# EasyEDA Pro project ProPrj_Pi Essential HAT.epro, schematic Schematic1
Board Name: Board1; Create Date: 2026-06-19; Page Name: P1; Project Name: Pi Essential HAT; Schematic Name: Schematic1; Update Date: 2026-06-19; Company: EasyEDA.com; Page Size: A4; Version: V1.0
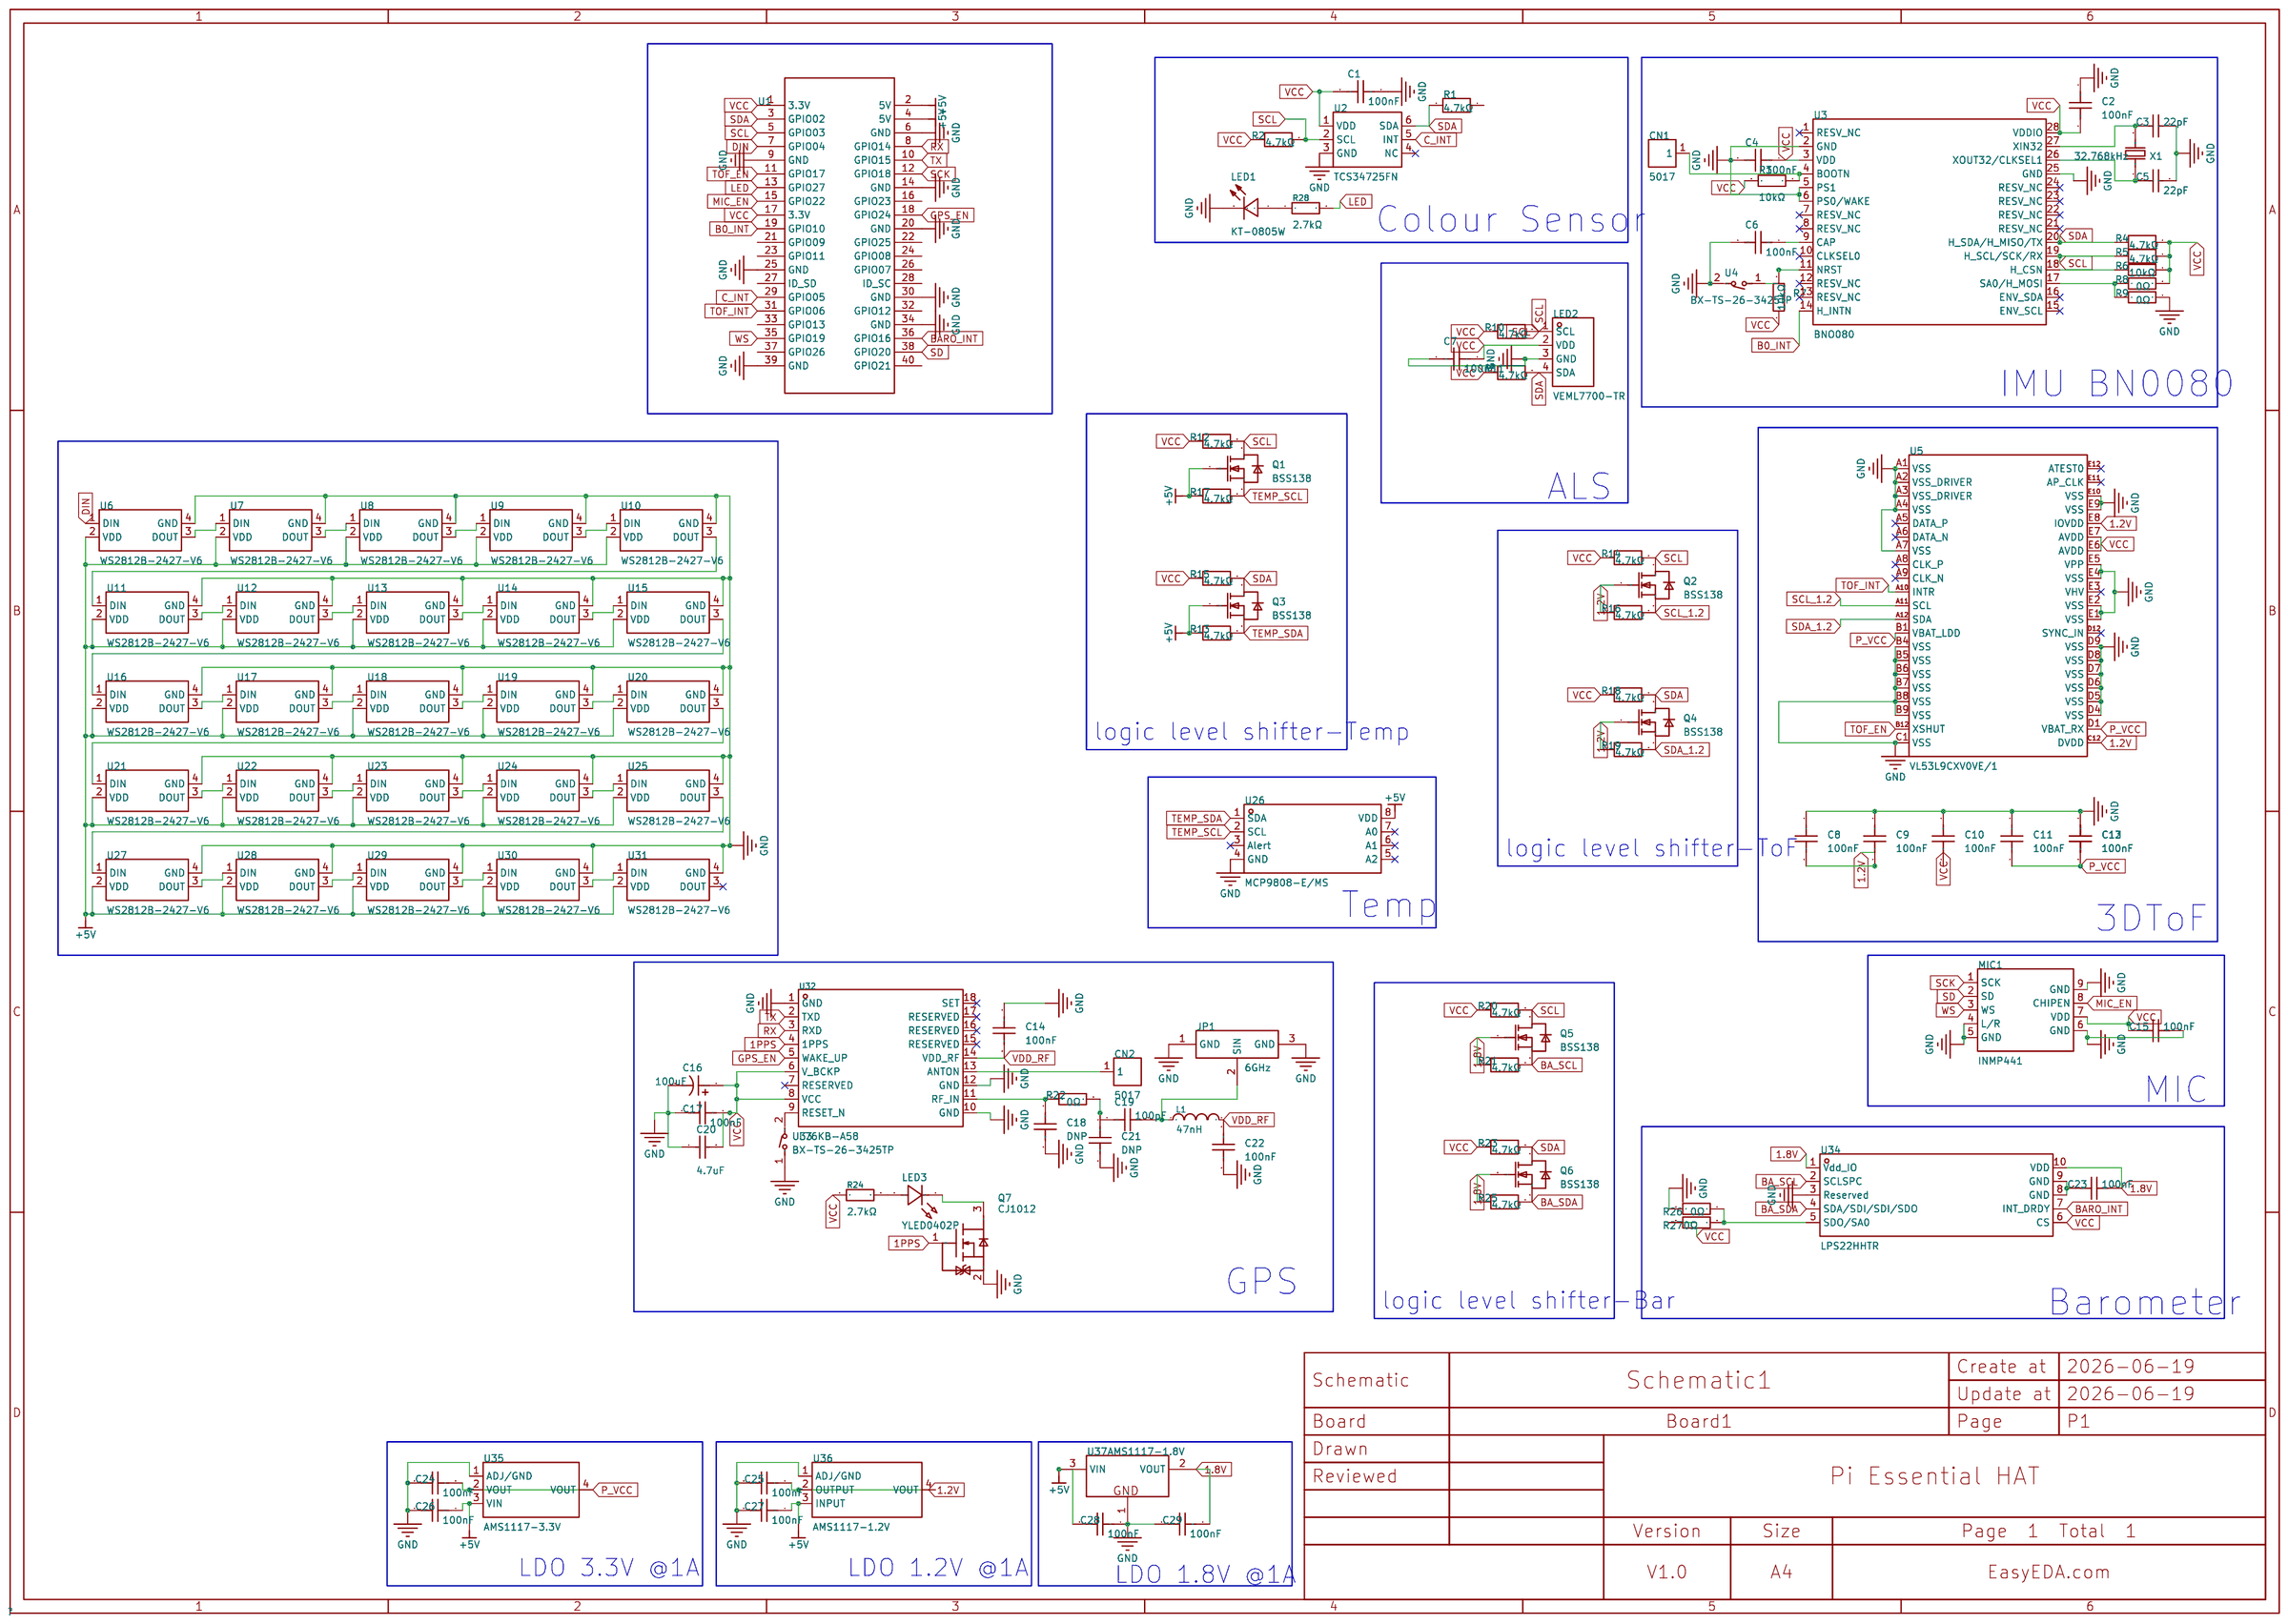
[diagram p0: schematic sheet]

## Parts
C1  100nF  [C0201]
C2  100nF  [C0201]
C3  22pF  [C0402]
C4  100nF  [C0201]
C5  22pF  [C0402]
C6  100nF  [C0201]
C7  100nF  [C0201]
C8  100nF  [C0201]
C9  100nF  [C0201]
C10  100nF  [C0201]
C11  100nF  [C0201]
C12  100nF  [C0201]
C13  100nF  [C0201]
C14  100nF  [C0201]
C15  100nF  [C0201]
C16  100uF  [CAP-SMD_BD5.0-L5.3-W5.3-RD]
C17  100nF  [C0201]
C18  DNP  [C0603]
C19  100pF  [C0201]
C20  4.7uF  [C0201]
C21  DNP  [C0603]
C22  100nF  [C0201]
C23  100nF  [C0201]
C24  100nF  [C0201]
C25  100nF  [C0201]
C26  100nF  [C0201]
C27  100nF  [C0201]
C28  100nF  [C0201]
C29  100nF  [C0201]
CN1  5017  [CONN-SMD_5017]
CN2  5017  [CONN-SMD_5017]
JP1  6GHz  [ANT-SMD_UFL-R-SMT-1-10]
L1  47nH  [L0201-RD]
LED1  KT-0805W  [LED0805-R-RD]
LED2  VEML7700-TR  [LED-SMD_4P-L6.8-W2.4_VEML7700-TR]
LED3  YLED0402P  [LED0402-RD]
MIC1  INMP441  [MIC-SMD_INMP441]
Q1  BSS138  [SOT-23-3_L2.9-W1.3-P1.90-LS2.4-BR-1]
Q2  BSS138  [SOT-23-3_L2.9-W1.3-P1.90-LS2.4-BR-1]
Q3  BSS138  [SOT-23-3_L2.9-W1.3-P1.90-LS2.4-BR-1]
Q4  BSS138  [SOT-23-3_L2.9-W1.3-P1.90-LS2.4-BR-1]
Q5  BSS138  [SOT-23-3_L2.9-W1.3-P1.90-LS2.4-BR-1]
Q6  BSS138  [SOT-23-3_L2.9-W1.3-P1.90-LS2.4-BR-1]
Q7  CJ1012  [SOT-523_L1.6-W0.8-P1.00-LS1.6-BR]
R1  4.7kΩ  [R0201]
R2  4.7kΩ  [R0201]
R3  10kΩ  [R0201]
R4  4.7kΩ  [R0201]
R5  4.7kΩ  [R0201]
R6  10kΩ  [R0201]
R7  10kΩ  [R0201]
R8  0Ω  [R0402]
R9  0Ω  [R0402]
R10  4.7kΩ  [R0201]
R11  4.7kΩ  [R0201]
R12  4.7kΩ  [R0201]
R13  4.7kΩ  [R0201]
R14  4.7kΩ  [R0201]
R15  4.7kΩ  [R0201]
R16  4.7kΩ  [R0201]
R17  4.7kΩ  [R0201]
R18  4.7kΩ  [R0201]
R19  4.7kΩ  [R0201]
R20  4.7kΩ  [R0201]
R21  4.7kΩ  [R0201]
R22  0Ω  [R0402]
R23  4.7kΩ  [R0201]
R24  2.7kΩ  [R0402]
R25  4.7kΩ  [R0201]
R26  0Ω  [R0402]
R27  0Ω  [R0402]
R28  2.7kΩ  [R0402]
U1  -  [RASPI_GPIO_B+_PIN]
U2  TCS34725FN  [SENSOR-SMD_TCS34725FN]
U3  BNO080  [LGA-28_L5.2-W3.8-P0.50-BL-1]
U4  BX-TS-26-3425TP  [KEY-SMD_L3.9-W3.0-LS5.0-EH]
U5  VL53L9CXV0VE/1  [COMM-SMD_42P-L12.8-W6.1_VL53L9CXV0VE-1]
U6  WS2812B-2427-V6  [LED-SMD_4P-L2.7-W2.4-P1.30_WS2812B-2427-V6]
U7  WS2812B-2427-V6  [LED-SMD_4P-L2.7-W2.4-P1.30_WS2812B-2427-V6]
U8  WS2812B-2427-V6  [LED-SMD_4P-L2.7-W2.4-P1.30_WS2812B-2427-V6]
U9  WS2812B-2427-V6  [LED-SMD_4P-L2.7-W2.4-P1.30_WS2812B-2427-V6]
U10  WS2812B-2427-V6  [LED-SMD_4P-L2.7-W2.4-P1.30_WS2812B-2427-V6]
U11  WS2812B-2427-V6  [LED-SMD_4P-L2.7-W2.4-P1.30_WS2812B-2427-V6]
U12  WS2812B-2427-V6  [LED-SMD_4P-L2.7-W2.4-P1.30_WS2812B-2427-V6]
U13  WS2812B-2427-V6  [LED-SMD_4P-L2.7-W2.4-P1.30_WS2812B-2427-V6]
U14  WS2812B-2427-V6  [LED-SMD_4P-L2.7-W2.4-P1.30_WS2812B-2427-V6]
U15  WS2812B-2427-V6  [LED-SMD_4P-L2.7-W2.4-P1.30_WS2812B-2427-V6]
U16  WS2812B-2427-V6  [LED-SMD_4P-L2.7-W2.4-P1.30_WS2812B-2427-V6]
U17  WS2812B-2427-V6  [LED-SMD_4P-L2.7-W2.4-P1.30_WS2812B-2427-V6]
U18  WS2812B-2427-V6  [LED-SMD_4P-L2.7-W2.4-P1.30_WS2812B-2427-V6]
U19  WS2812B-2427-V6  [LED-SMD_4P-L2.7-W2.4-P1.30_WS2812B-2427-V6]
U20  WS2812B-2427-V6  [LED-SMD_4P-L2.7-W2.4-P1.30_WS2812B-2427-V6]
U21  WS2812B-2427-V6  [LED-SMD_4P-L2.7-W2.4-P1.30_WS2812B-2427-V6]
U22  WS2812B-2427-V6  [LED-SMD_4P-L2.7-W2.4-P1.30_WS2812B-2427-V6]
U23  WS2812B-2427-V6  [LED-SMD_4P-L2.7-W2.4-P1.30_WS2812B-2427-V6]
U24  WS2812B-2427-V6  [LED-SMD_4P-L2.7-W2.4-P1.30_WS2812B-2427-V6]
U25  WS2812B-2427-V6  [LED-SMD_4P-L2.7-W2.4-P1.30_WS2812B-2427-V6]
U26  MCP9808-E/MS  [MSOP-8_L3.0-W3.0-P0.65-LS4.9-BL]
U27  WS2812B-2427-V6  [LED-SMD_4P-L2.7-W2.4-P1.30_WS2812B-2427-V6]
U28  WS2812B-2427-V6  [LED-SMD_4P-L2.7-W2.4-P1.30_WS2812B-2427-V6]
U29  WS2812B-2427-V6  [LED-SMD_4P-L2.7-W2.4-P1.30_WS2812B-2427-V6]
U30  WS2812B-2427-V6  [LED-SMD_4P-L2.7-W2.4-P1.30_WS2812B-2427-V6]
U31  WS2812B-2427-V6  [LED-SMD_4P-L2.7-W2.4-P1.30_WS2812B-2427-V6]
U32  L76KB-A58  [GPSM-SMD_18P-L10.1-W9.7-P1.10]
U33  BX-TS-26-3425TP  [KEY-SMD_L3.9-W3.0-LS5.0-EH]
U34  LPS22HHTR  [HLGA-10L_LPS22HBTR]
U35  AMS1117-3.3V  [SOT-223-4_L6.5-W3.5-P2.30-LS7.0-BR]
U36  AMS1117-1.2V  [SOT-223-4_L6.5-W3.5-P2.30-LS7.0-BR]
U37  AMS1117-1.8V  [SOT-223-3_L6.7-W3.7-P2.30-LS7.0-BR_2]
X1  32.768kHz  [OSC-SMD_L3.2-W1.5]

## Library data of the parts
C1 C2 C4 C6-C15 C17 C22-C29 = CL03A104KO3NNNC: Capacitance:100nF Tolerance:±10% Tolerance:±10% Voltage Rating:16V Temperature Coefficient:X5R; LCSC Part Name: 100nF ±10% 16V; Supplier Part: C307380; Manufacturer: SAMSUNG(三星); Supplier Footprint: 0201; JLCPCB Part Class: Extended Part; Datasheet: https://item.szlcsc.com/datasheet/CL03A104KO3NNNC/291054.html; Supplier: LCSC; Tolerance: ±10%; Voltage Rating: 16V; Temperature Coefficient: X5R
C3 C5 = 0402CG220J500NT: Capacitance:22pF Tolerance:±5% Tolerance:±5% Voltage Rating:50V Temperature Coefficient:C0G; LCSC Part Name: 22pF ±5% 50V; Supplier Part: C1555; Manufacturer: FH(风华); Supplier Footprint: 0402; JLCPCB Part Class: Basic Part; Datasheet: https://item.szlcsc.com/datasheet/0402CG220J500NT/1907.html; Supplier: LCSC; Tolerance: ±5%; Voltage Rating: 50V; Temperature Coefficient: C0G
C16 = FVH010ADA101M0554: Capacitance:100uF Tolerance:±20% Tolerance:±20% Voltage Rating:10V Diameter:5mm Height - Seated (Max):5.4mm Operating Temperature:-55℃~+105℃ Operating Temperature:-55℃~+105℃; LCSC Part Name: 100uF ±20% 10V; Supplier Part: C7469983; Manufacturer: FOSAN(富捷/富信); Supplier Footprint: 5x5.4; JLCPCB Part Class: Extended Part; Datasheet: https://item.szlcsc.com/datasheet/FVH010ADA101M0554/8518815.html; Supplier: LCSC; Tolerance: ±20%; Voltage Rating: 10V; Diameter: 5mm; Height - Seated (Max): 5.4mm; Operating Temperature: -55℃~+105℃
C18 C21 = CAP_0603: Supplier Footprint: 0603
C19 = GRM0332C1H101JA01D: Capacitance:100pF Tolerance:±5% Tolerance:±5% Voltage Rating:50V Temperature Coefficient:-; LCSC Part Name: 100pF ±5% 50V; Supplier Part: C5354870; Manufacturer: muRata(村田); Supplier Footprint: 0201; JLCPCB Part Class: Extended Part; Datasheet: https://item.szlcsc.com/datasheet/GRM0332C1H101JA01D/6153004.html; Supplier: LCSC; Tolerance: ±5%; Voltage Rating: 50V
C20 = CM03X5R475M06AH055: Capacitance:4.7uF Tolerance:±20% Tolerance:±20% Voltage Rating:6.3V Temperature Coefficient:X5R; LCSC Part Name: 4.7uF ±20% 6.3V; Supplier Part: C253012; Manufacturer: Kyocera AVX; Supplier Footprint: 0201; JLCPCB Part Class: Extended Part; Supplier: LCSC; Tolerance: ±20%; Voltage Rating: 6.3V; Temperature Coefficient: X5R
CN1 CN2 = 5017: Supplier Part: C9900015874; Supplier Footprint: Testpoint_SMD; JLCPCB Part Class: Extended Part; Supplier: LCSC
JP1 = U.FL-R-SMT-1(10): Connector Type:Board Side Interface:Male Pin Number of Ports:1 Interface Diameter:2mm Interface Length/Height:1.25mm Frequency:6GHz RF Series:IPEX Impedance:50Ω Style:- Operating Temperature Range:-40℃~+90℃ Operating Temperature Range:-40℃~+90℃; LCSC Part Name: IPEX 内针; Supplier Part: C88373; Manufacturer: HRS(广濑); Supplier Footprint: SMD; JLCPCB Part Class: Extended Part; Datasheet: https://item.szlcsc.com/datasheet/U.FL-R-SMT-1(10)/89552.html; Supplier: LCSC; Connector Type: Board Side; Interface: Male Pin; Number of Ports: 1; Interface Diameter: 2mm; Interface Length/Height: 1.25mm; RF Series: IPEX; Impedance: 50Ω; Operating Temperature Range: -40℃~+90℃
L1 = LQP03TN47NH02D: Inductance:47nH Tolerance:±3% Tolerance:±3% Current Rating:100mA Current - Saturation (Isat):- DC Resistance(DCR):3.6Ω Q @ Frequency:9@300MHz Frequency - Self Resonant:1.3GHz Ratings:- Type:Thick Film Inductor; LCSC Part Name: 47nH ±3%; Supplier Part: C162618; Manufacturer: muRata(村田); Supplier Footprint: 0201; JLCPCB Part Class: Extended Part; Datasheet: https://item.szlcsc.com/datasheet/LQP03TN47NH02D/173999.html; Supplier: LCSC; Tolerance: ±3%; Current Rating: 100mA; DC Resistance(DCR): 3.6Ω; Q @ Frequency: 9@300MHz; Frequency - Self Resonant: 1.3GHz; Type: Thick Film Inductor
LED1 = KT-0805W: Lamp Holder Type:2mm x 1.25mm square LED Illumination Color:White Voltage - Forward(Vf):2.6V~3.2V Voltage - Forward(Vf):2.6V~3.2V Power(Watts):80mW Forward Current:25mA Wavelength - Dominant:- Wavelength - Dominant:- Peak Wavelength:- Peak Wavelength:- Di; LCSC Part Name: 0805 白灯 高亮; Supplier Part: C34499; Manufacturer: KENTO; Supplier Footprint: 0805; JLCPCB Part Class: Basic Part; Datasheet: https://item.szlcsc.com/datasheet/KT-0805W/35468.html; Supplier: LCSC; Lamp Holder Type: 2mm x 1.25mm square LED; Illumination Color: White; Voltage - Forward(Vf): 2.6V~3.2V; Power(Watts): 80mW; Forward Current: 25mA; Diode Configuration: Discrete Diode; Lens Color: Yellow Lens; Color Temperature: 13172K~100000K; Luminous Intensity: 350mcd; Viewing Angle: 120°; Mounting Style: Top-mount; Operating Temperature: -30℃~+85℃
LED2 = VEML7700-TR: Measurement Type:Light Intensity Photoperceptivity:120klx Interface:I2C Resolution(Bits):16bit Voltage - Supply:2.5V~3.6V Voltage - Supply:2.5V~3.6V Operating Temperature:-25℃~+85℃ Operating Temperature:-25℃~+85℃ Length:6.8mm Width:2.35mm Height:3mm; LCSC Part Name: I2C接口的高精度环境光传感器; Supplier Part: C504893; Manufacturer: VISHAY(威世); Supplier Footprint: SMD-4P; JLCPCB Part Class: Extended Part; Datasheet: https://item.szlcsc.com/datasheet/VEML7700-TR/519982.html; Supplier: LCSC; Measurement Type: Light Intensity; Photoperceptivity: 120klx; Interface: I2C; Resolution(Bits): 16bit; Voltage - Supply: 2.5V~3.6V; Operating Temperature: -25℃~+85℃; Length: 6.8mm; Width: 2.35mm; Height: 3mm
LED3 = YLED0402P: Lamp Holder Type:- Illumination Color:Purple Voltage - Forward(Vf):2.6V~3V Voltage - Forward(Vf):2.6V~3V Power(Watts):70mW Forward Current:5mA Wavelength - Dominant:- Wavelength - Dominant:- Peak Wavelength:- Peak Wavelength:- Diode Configuration:Discrete; LCSC Part Name: 紫色 独立二极管; Supplier Part: C41366936; Manufacturer: YONGYUTAI(永裕泰); Supplier Footprint: 0402; JLCPCB Part Class: Extended Part; Datasheet: https://item.szlcsc.com/datasheet/YLED0402P/43116910.html; Supplier: LCSC; Illumination Color: Purple; Voltage - Forward(Vf): 2.6V~3V; Power(Watts): 70mW; Forward Current: 5mA; Diode Configuration: Discrete Diode; Luminous Intensity: 145mcd; Viewing Angle: 120°; Operating Temperature: -40℃~+85℃
MIC1 = INMP441: Supplier Part: C5438445; Manufacturer: TDK InvenSense(应美盛); Supplier Footprint: SMD-9; JLCPCB Part Class: Extended Part; Datasheet: https://item.szlcsc.com/datasheet/INMP441/6315022.html; Supplier: LCSC
Q1-Q6 = BSS138: Type:1 N-channel Drain Source Voltage (Vdss): Continuous Drain Current (Id): Drain Source On Resistance (RDS(on)@Vgs,Id):3.5Ω@4.5V,220mA Power Dissipation (Pd): Gate Threshold Voltage (Vgs(th)@Id):1.6V@1mA Total Gate Charge (Qg@Vgs):- Input Capacitance (C; LCSC Part Name: N沟道,电流:220mA,耐压:50V; Supplier Part: C3015220; Manufacturer: KUU; Supplier Footprint: SOT-23; JLCPCB Part Class: Extended Part; Datasheet: https://atta.szlcsc.com/upload/public/pdf/source/20220516/125DEF07DB3AB32C02C9AD402DEFFF8E.pdf; Supplier: LCSC; Type: 1 N-channel; Drain Source On Resistance (RDS(on)@Vgs,Id): 3.5Ω@4.5V,220mA; Gate Threshold Voltage (Vgs(th)@Id): 1.6V@1mA; Input Capacitance (Ciss@Vds): 50pF@25V; Operating Temperature: -55℃~+150℃
Q7 = CJ1012: Number:1 N-Channel Drain to Source Voltage:20V Current - Continuous Drain(Id):500mA RDS(on):700mΩ@4.5V Pd - Power Dissipation:150mW Gate Threshold Voltage (Vgs(th)):1.2V@250uA Gate Charge(Qg):750pC@4.5V Input Capacitance(Ciss):100pF Reverse Transfer Capac; LCSC Part Name: 1个N沟道 耐压:20V 电流:500mA; Supplier Part: C2991967; Manufacturer: CJ(江苏长电/长晶); Supplier Footprint: SOT-523; JLCPCB Part Class: Extended Part; Datasheet: https://item.szlcsc.com/datasheet/CJ1012/3454611.html; Supplier: LCSC; Number: 1 N-Channel; Drain to Source Voltage: 20V; Current - Continuous Drain(Id): 500mA; RDS(on): 700mΩ@4.5V; Pd - Power Dissipation: 150mW; Gate Threshold Voltage (Vgs(th)): 1.2V@250uA; Gate Charge(Qg): 750pC@4.5V; Input Capacitance(Ciss): 100pF; Reverse Transfer Capacitance (Crss@Vds): 12pF; Operating Temperature: -55℃~+150℃; Type: N-Channel; Output Capacitance(Coss): 16pF
R1 R2 R4 R5 R10-R21 R23 R25 = FRC0201F4701TS: Type:Thick Film Resistor Resistance:4.7kΩ Tolerance:±1% Tolerance:±1% Power(Watts):50mW Temperature Coefficient:±200ppm/℃ Temperature Coefficient:±200ppm/℃; LCSC Part Name: 厚膜电阻 4.7kΩ ±1% 50mW; Supplier Part: C7467278; Manufacturer: FOJAN(富捷); Supplier Footprint: 0201; JLCPCB Part Class: Extended Part; Datasheet: https://item.szlcsc.com/datasheet/FRC0201F4701TS/8513894.html; Supplier: LCSC; Type: Thick Film Resistor; Tolerance: ±1%; Power(Watts): 50mW; Temperature Coefficient: ±200ppm/℃
R3 R6 R7 = RC0201JR-0710KL: Type:Thick Film Resistor Resistance:10kΩ Tolerance:±5% Tolerance:±5% Power(Watts):50mW Voltage-Supply(Max):25V Temperature Coefficient:±200ppm/℃ Temperature Coefficient:±200ppm/℃ Operating Temperature:-55℃~+125℃ Operating Temperature:-55℃~+125℃; LCSC Part Name: 厚膜电阻 10kΩ ±5% 50mW; Supplier Part: C138117; Manufacturer: YAGEO(国巨); Supplier Footprint: 0201; JLCPCB Part Class: Extended Part; Datasheet: https://item.szlcsc.com/datasheet/RC0201JR-0710KL/149433.html; Supplier: LCSC; Type: Thick Film Resistor; Tolerance: ±5%; Power(Watts): 50mW; Voltage-Supply(Max): 25V; Temperature Coefficient: ±200ppm/℃; Operating Temperature: -55℃~+125℃
R8 R9 R22 R26 R27 = CRCW04020000Z0ED: Type:Thick Film Resistors Resistance:0Ω Tolerance:- Tolerance:- Power(Watts):62.5mW Voltage-Supply(Max):50V Temperature Coefficient:- Temperature Coefficient:- Operating Temperature:-55℃~+155℃ Operating Temperature:-55℃~+155℃; LCSC Part Name: 厚膜电阻 0Ω 62.5mW; Supplier Part: C190119; Manufacturer: VISHAY(威世); Supplier Footprint: 0402; JLCPCB Part Class: Extended Part; Datasheet: https://item.szlcsc.com/datasheet/CRCW04020000Z0ED/208652.html; Supplier: LCSC; Type: Thick Film Resistors; Power(Watts): 62.5mW; Voltage-Supply(Max): 50V; Operating Temperature: -55℃~+155℃
R24 R28 = RMC04022.7K1%N: Type:Thick Film Resistor Resistance:2.7kΩ Tolerance:±1% Tolerance:±1% Power(Watts):62.5mW Voltage-Supply(Max):50V Temperature Coefficient:±100ppm/℃ Temperature Coefficient:±100ppm/℃ Operating Temperature:-55℃~+155℃ Operating Temperature:-55℃~+155℃; LCSC Part Name: 2.7kΩ ±1% 62.5mW; Supplier Part: C325419; Manufacturer: Tyohm(幸亚电阻); Supplier Footprint: 0402; JLCPCB Part Class: Extended Part; Datasheet: https://item.szlcsc.com/datasheet/RMC04022.7K1%2525N/305724.html; Supplier: LCSC; Type: Thick Film Resistor; Tolerance: ±1%; Power(Watts): 62.5mW; Voltage-Supply(Max): 50V; Temperature Coefficient: ±100ppm/℃; Operating Temperature: -55℃~+155℃
U1 = 40-Pin Female Header
U2 = TCS34725FN: Measurement Type:Color Recognition Detection color:Red, Green, Blue, Transparent Interface:I2C Resolution(Bits):16bit Voltage - Supply:2.7V~3.6V Voltage - Supply:2.7V~3.6V Quiescent Current:235uA Operating Temperature:-30℃~+70℃ Operating Temperature:-30℃~; LCSC Part Name: TCS34725FN 停产; Supplier Part: C2649487; Manufacturer: ams(艾迈斯半导体); Supplier Footprint: SMD-6P; JLCPCB Part Class: Extended Part; Datasheet: https://item.szlcsc.com/datasheet/TCS34725FN/2741396.html; Supplier: LCSC; Measurement Type: Color Recognition; Detection color: Red, Green, Blue, Transparent; Interface: I2C; Resolution(Bits): 16bit; Voltage - Supply: 2.7V~3.6V; Quiescent Current: 235uA; Operating Temperature: -30℃~+70℃; Features: Low power/sleep mode；Interrupt/event trigger；Spectral correction/filtering；Adjustable gain control
U3 = BNO080: Accelerometer Sensing Axis:X,Y,Z Acceleration Measurement Range (MAX):±8g Acceleration Measurement Range (MAX):±8g Gyroscope Sensing Axis:X,Y,Z Gyroscope Measurement Range (MAX):±2000dps Gyroscope Measurement Range (MAX):±2000dps Sensor Type:IMU (accelero; Supplier Part: C717991; Manufacturer: CEVA; Supplier Footprint: LGA-28(5.2x3.8); JLCPCB Part Class: Extended Part; Datasheet: https://item.szlcsc.com/datasheet/BNO080/759543.html; Supplier: LCSC; Accelerometer Sensing Axis: X,Y,Z; Acceleration Measurement Range (MAX): ±8g; Gyroscope Sensing Axis: X,Y,Z; Gyroscope Measurement Range (MAX): ±2000dps; Sensor Type: IMU (accelerometer + gyroscope); Output Bits: 16bit；12bit; Interface: SPI；UART；I2C; Voltage - Supply: 2.4V~3.6V；1.65V~3.6V; Standby Current: 1.9uA；1.5uA; Operating Temperature: -40℃~+85℃; Features: Motion event detection；Synchronization and timestamp
U4 U33 = BX-TS-26-3425TP: Circuit:SPST Actuator Style:Round Button Operating Force:2.6N Mounting Type:Surface Mount,Vertical Length:3mm Width:4mm Switch Height:2.5mm with Bracket:Without Bracket Contact Current:50mA Voltage Rating:12V Actuator/Cap Color:Black Termination Style:Gul; LCSC Part Name: 3x4x2.5贴片开关带柱; Supplier Part: C18078118; Manufacturer: Bossie(博锡); Supplier Footprint: SMD,3x4mm; JLCPCB Part Class: Extended Part; Datasheet: https://item.szlcsc.com/datasheet/BX-TS-26-3425TP/19218519.html; Supplier: LCSC; Circuit: SPST; Actuator Style: Round Button; Operating Force: 2.6N; Mounting Type: Surface Mount,Vertical; Length: 3mm; Width: 4mm; Switch Height: 2.5mm; with Bracket: Without Bracket; Contact Current: 50mA; Voltage Rating: 12V; Actuator/Cap Color: Black; Termination Style: Gull Wing; Life: 100,000 Cycles; Operating Temperature: -30℃~+80℃
U5 = VL53L9CXV0VE/1: Supplier Part: C9900262238; Supplier Footprint: Optical LGA 12.8 x 6.1 x 4.6 mm; Supplier: LCSC
U6-U25 U27-U31 = WS2812B-2427-V6_C52941389: Supplier Part: C52941389; Manufacturer: worldsemi; Supplier Footprint: SMD-4P,2.7x2.4mm; JLCPCB Part Class: Extended Part; Datasheet: https://item.szlcsc.com/datasheet/WS2812B-2427-V6/55856752.html; Supplier: LCSC
U26 = MCP9808-E/MS: Detection Temperature Range:-40℃~+125℃ Detection Temperature Range:-40℃~+125℃ Tolerance:±0.5℃ Tolerance:±0.5℃ Voltage - Supply:2.7V~5.5V Voltage - Supply:2.7V~5.5V Standby Current:- Interface:I2C；SMBus Temperature Conversion Time:250ms Temperature Resolut; LCSC Part Name: ±0.5℃最高精度数字温度传感器; Supplier Part: C94847; Manufacturer: MICROCHIP(美国微芯); Supplier Footprint: MSOP-8; JLCPCB Part Class: Extended Part; Datasheet: https://item.szlcsc.com/datasheet/MCP9808-E%252FMS/96047.html; Supplier: LCSC; Detection Temperature Range: -40℃~+125℃; Tolerance: ±0.5℃; Voltage - Supply: 2.7V~5.5V; Interface: I2C；SMBus; Temperature Conversion Time: 250ms; Temperature Resolution: 13bit
U32 = L76KB-A58: LCSC Part Name: 超小尺寸、紧凑型多系统联合定位 GNSS 模块; Supplier Part: C2916234; Manufacturer: Quectel(移远); Supplier Footprint: SMD,9.7x10.1mm; JLCPCB Part Class: Extended Part; Datasheet: https://item.szlcsc.com/datasheet/L76KB-A58/3211442.html; Supplier: LCSC
U34 = LPS22HHTR: Pressure range:26Kpa~1.26bar Pressure range:26Kpa~1.26bar Voltage - Supply:1.7V~3.6V Voltage - Supply:1.7V~3.6V Standby Current:900nA Interface:I3C；SPI；I2C Module:- Absolute Accuracy:0.5hpa Relative Accuracy:0.025hpa Features:On-chip temperature compensat; LCSC Part Name: 高性能MEMS纳米压力传感器; Supplier Part: C2827824; Manufacturer: ST(意法半导体); Supplier Footprint: HLGA-10(2x2); JLCPCB Part Class: Extended Part; Datasheet: https://item.szlcsc.com/datasheet/LPS22HHTR/2974745.html; Supplier: LCSC; Pressure range: 26Kpa~1.26bar; Voltage - Supply: 1.7V~3.6V; Standby Current: 900nA; Interface: I3C；SPI；I2C; Absolute Accuracy: 0.5hpa; Relative Accuracy: 0.025hpa; Features: On-chip temperature compensation；Integrated ADC and digital interface；On-chip temperature output；On-chip calibration and non-volatile storage；Integrated signal amplifier; Operating Temperature: -40℃~+85℃
U35 = AMS1117-3.3V_C2688239: Output Configuration:Positive Voltage - Supply:12V Output Voltage:3.3V Output Voltage:3.3V Output Current:1A Power Supply Rejection Ratio (PSRR):70dB@(120Hz) Voltage Dropout:1.4V@(1A) standby current:5mA Noise:0.003%Vout Features:- Operating Temperature:-; LCSC Part Name: 3.3V 1A 12V; Supplier Part: C2688239; Manufacturer: WPMtek(维攀); Supplier Footprint: SOT-223-3L; JLCPCB Part Class: Extended Part; Datasheet: https://item.szlcsc.com/datasheet/AMS1117-3.3V/2793377.html; Supplier: LCSC; Output Configuration: Positive; Voltage - Supply: 12V; Output Voltage: 3.3V; Output Current: 1A; Power Supply Rejection Ratio (PSRR): 70dB@(120Hz); Voltage Dropout: 1.4V@(1A); standby current: 5mA; Noise: 0.003%Vout; Operating Temperature: -40℃~+125℃@(Tj); Output Type: Fixed; Number of Outputs: 1
U36 = AMS1117-1.2V_C46473008: Output Configuration:Positive Voltage - Supply:18V Output Voltage:1.2V Output Voltage:1.2V Output Current:1A Power Supply Rejection Ratio (PSRR):- Voltage Dropout:1.26V@(1A) standby current:4mA Noise:- Features:Over Current Protection；Thermal shutdown Ope; LCSC Part Name: 1A; Supplier Part: C46473008; Manufacturer: TECH PUBLIC(台舟); Supplier Footprint: SOT-223; Datasheet: https://item.szlcsc.com/datasheet/AMS1117-1.2V/48592828.html; Supplier: LCSC; Output Configuration: Positive; Voltage - Supply: 18V; Output Voltage: 1.2V; Output Current: 1A; Voltage Dropout: 1.26V@(1A); standby current: 4mA; Features: Over Current Protection；Thermal shutdown; Operating Temperature: -50℃~+140℃; Output Type: Fixed; Number of Outputs: 1
U37 = AMS1117-1.8V_C7380514: Output Configuration:Positive Voltage - Supply:15V Output Voltage:1.8V Output Voltage:1.8V Output Current:1A Power Supply Rejection Ratio (PSRR):- Voltage Dropout:1.4V@(1A) standby current:2mA Noise:- Features:Thermal shutdown Operating Temperature:0℃~+12; LCSC Part Name: 1.8V 1A 15V; Supplier Part: C7380514; Manufacturer: MSKSEMI(美森科); Supplier Footprint: SOT-223; JLCPCB Part Class: Extended Part; Datasheet: https://item.szlcsc.com/datasheet/AMS1117-1.8V/8361431.html; Supplier: LCSC; Output Configuration: Positive; Voltage - Supply: 15V; Output Voltage: 1.8V; Output Current: 1A; Voltage Dropout: 1.4V@(1A); standby current: 2mA; Features: Thermal shutdown; Operating Temperature: 0℃~+125℃@(Ta); Output Type: Fixed; Number of Outputs: 1
X1 = SC-32S32.768kHz20PPM12.5pF: Type:- Frequency:32.768kHz Normal temperature Frequency Tolerance:±20ppm Normal temperature Frequency Tolerance:±20ppm Load Capacitance:12.5pF Operating Temperature:- Operating Temperature:-; LCSC Part Name: 32.768kHz ±20ppm 12.5pF; Supplier Part: C97606; Manufacturer: Seiko(精工); Supplier Footprint: SMD3215-2P; JLCPCB Part Class: Extended Part; Datasheet: https://atta.szlcsc.com/upload/public/pdf/source/20170713/C97606_1499914220652816606.pdf; Supplier: LCSC; Normal temperature Frequency Tolerance: ±20ppm; Load Capacitance: 12.5pF

## Nets
1.2V: C8.2 C9.2 C25.1 Q2.1(G) Q4.1(G) R16.1 R19.1 U5.C12(DVDD) U5.E8(IOVDD) U36.2(OUTPUT)
1.8V: C23.1 C29.1 Q5.1(G) Q6.1(G) R21.1 R25.1 U34.1(Vdd_IO) U34.10(VDD) U37.2(VOUT)
+5V: C26.1 C27.1 C28.2 Q1.1(G) Q3.1(G) R13.1 R17.1 U1.2(5V) U1.4(5V) U6.2(VDD) U7.2(VDD) U8.2(VDD) U9.2(VDD) U10.2(VDD) U11.2(VDD) U12.2(VDD) U13.2(VDD) U14.2(VDD) U15.2(VDD) U16.2(VDD) U17.2(VDD) U18.2(VDD) U19.2(VDD) U20.2(VDD) U21.2(VDD) U22.2(VDD) U23.2(VDD) U24.2(VDD) U25.2(VDD) U26.8(VDD) U27.2(VDD) U28.2(VDD) U29.2(VDD) U30.2(VDD) U31.2(VDD) U35.3(VIN) U36.3(INPUT) U37.3(VIN)
GND: C1.1 C2.1 C3.2 C4.2 C5.2 C6.2 C7.2 C8.1 C9.1 C10.1 C11.1 C12.1 C13.1 C14.1 C15.1 C16.2 C17.2 C18.2 C20.1 C21.2 C22.2 C24.2 C25.2 C26.2 C27.2 C28.1 C29.2 JP1.1(GND) JP1.3(GND) LED1.2(K) LED2.3(GND) MIC1.4(L/R) MIC1.5(GND) MIC1.6(GND) MIC1.9(GND) Q7.2(S) R9.2 R26.2 U1.6(GND) U1.9(GND) U1.14(GND) U1.20(GND) U1.25(GND) U1.30(GND) U1.34(GND) U1.39(GND) U2.3(GND) U3.2(GND) U3.5(PS1) U3.6(PS0/WAKE) U3.25(GND) U4.2 U5.A1(VSS) U5.A2(VSS_DRIVER) U5.A3(VSS_DRIVER) U5.A4(VSS) U5.A7(VSS) U5.B4(VSS) U5.B5(VSS) U5.B6(VSS) U5.B7(VSS) U5.B8(VSS) U5.B9(VSS) U5.C1(VSS) U5.D4(VSS) U5.D5(VSS) U5.D6(VSS) U5.D7(VSS) U5.D8(VSS) U5.D9(VSS) U5.E1(VSS) U5.E2(VSS) U5.E4(VSS) U5.E5(VPP) U5.E9(VSS) U5.E10(VSS) U6.4(GND) U7.4(GND) U8.4(GND) U9.4(GND) U10.4(GND) U11.4(GND) U12.4(GND) U13.4(GND) U14.4(GND) U15.4(GND) U16.4(GND) U17.4(GND) U18.4(GND) U19.4(GND) U20.4(GND) U21.4(GND) U22.4(GND) U23.4(GND) U24.4(GND) U25.4(GND) U26.4(GND) U27.4(GND) U28.4(GND) U29.4(GND) U30.4(GND) U31.4(GND) U32.1(GND) U32.10(GND) U32.12(GND) U33.1 U34.3(Reserved) U35.1(ADJ/GND) U36.1(ADJ/GND) U37.1(GND)
VCC: C1.2 C2.2 C4.1 C7.1 C10.2 C15.2 C16.1 C17.1 C20.2 LED2.2(VDD) MIC1.7(VDD) R2.1 R3.2 R4.2 R5.2 R6.1 R7.1 R8.2 R10.1 R11.1 R12.1 R14.1 R15.1 R18.1 R20.1 R23.1 R24.1 R27.2 U1.1(3.3V) U1.17(3.3V) U2.1(VDD) U3.3(VDD) U3.28(VDDIO) U5.E6(AVDD) U5.E7(AVDD) U32.6(V_BCKP) U32.8(VCC) U34.6(CS)
VDD_RF: C14.2 C22.1 L1.2 U32.14(VDD_RF)
1PPS: Q7.1(G) U32.4(1PPS)
B0_INT: U1.19(GPIO10) U3.14(H_INTN)
BA_SCL: Q5.2(S) R21.2 U34.2(SCLSPC)
BA_SDA: Q6.2(S) R25.2 U34.4(SDA/SDI/SDI/SDO)
BARO_INT: U1.36(GPIO16) U34.7(INT_DRDY)
C_INT: U1.29(GPIO05) U2.5(INT)
DIN: U1.7(GPIO04) U6.1(DIN)
GPS_EN: U1.18(GPIO24) U32.5(WAKE_UP)
LED: R28.2 U1.13(GPIO27)
MIC_EN: MIC1.8(CHIPEN) U1.15(GPIO22)
P_VCC: C11.2 C12.2 C13.2 C24.1 U5.B1(VBAT_LDD) U5.D1(VBAT_RX) U35.2(VOUT) U35.4(VOUT)
RX: U1.8(GPIO14) U32.3(RXD)
SCK: MIC1.1(SCK) U1.12(GPIO18)
SCL: LED2.1(SCL) Q1.3(D) Q2.3(D) Q5.3(D) R2.2 R5.1 R10.2 R12.2 R14.2 R20.2 U1.5(GPIO03) U2.2(SCL) U3.19(H_SCL/SCK/RX)
SCL_1.2: Q2.2(S) R16.2 U5.A11(SCL)
SD: MIC1.2(SD) U1.38(GPIO20)
SDA: LED2.4(SDA) Q3.3(D) Q4.3(D) Q6.3(D) R1.2 R4.1 R11.2 R15.2 R18.2 R23.2 U1.3(GPIO02) U2.6(SDA) U3.20(H_SDA/H_MISO/TX)
SDA_1.2: Q4.2(S) R19.2 U5.A12(SDA)
TEMP_SCL: Q1.2(S) R17.2 U26.2(SCL)
TEMP_SDA: Q3.2(S) R13.2 U26.1(SDA)
TOF_EN: U1.11(GPIO17) U5.B12(XSHUT)
TOF_INT: U1.31(GPIO06) U5.A10(INTR)
TX: U1.10(GPIO15) U32.2(TXD)
WS: MIC1.3(WS) U1.35(GPIO19)
$1N145: R26.1 R27.1 U34.5(SDO/SA0)
$1N148: C23.2 U34.8(GND) U34.9(GND)
$1N179: C19.2 JP1.2(SIN) L1.1
$1N184: C19.1 C21.1 R22.2
$1N189: LED3.1(K) Q7.3(D)
$1N190: LED3.2(A) R24.2
$1N260: U6.3(DOUT) U7.1(DIN)
$1N261: U7.3(DOUT) U8.1(DIN)
$1N262: U8.3(DOUT) U9.1(DIN)
$1N263: U9.3(DOUT) U10.1(DIN)
$1N264: U14.3(DOUT) U15.1(DIN)
$1N265: U13.3(DOUT) U14.1(DIN)
$1N266: U12.3(DOUT) U13.1(DIN)
$1N267: U11.3(DOUT) U12.1(DIN)
$1N268: U16.3(DOUT) U17.1(DIN)
$1N269: U17.3(DOUT) U18.1(DIN)
$1N270: U18.3(DOUT) U19.1(DIN)
$1N271: U19.3(DOUT) U20.1(DIN)
$1N272: U24.3(DOUT) U25.1(DIN)
$1N273: U23.3(DOUT) U24.1(DIN)
$1N274: U22.3(DOUT) U23.1(DIN)
$1N275: U21.3(DOUT) U22.1(DIN)
$1N276: U27.3(DOUT) U28.1(DIN)
$1N277: U28.3(DOUT) U29.1(DIN)
$1N278: U29.3(DOUT) U30.1(DIN)
$1N280: U30.3(DOUT) U31.1(DIN)
$1N292: U25.3(DOUT) U27.1(DIN)
$1N293: U20.3(DOUT) U21.1(DIN)
$1N294: U15.3(DOUT) U16.1(DIN)
$1N295: U10.3(DOUT) U11.1(DIN)
$1N301: LED1.1(A) R28.1
Net-(C3-1): C3.1 U3.27(XIN32) X1.2
Net-(C5-1): C5.1 U3.26(XOUT32/CLKSEL1) X1.1
Net-(C6-1): C6.1 U3.9(CAP)
Net-(C18-1): C18.1 R22.1 U32.11(RF_IN)
Net-(CN1-1): CN1.1 R3.1 U3.4(BOOTN)
Net-(CN2-1): CN2.1 U32.13(ANTON)
Net-(R6-2): R6.2 U3.18(H_CSN)
Net-(R7-2): R7.2 U3.11(NRST) U4.1
Net-(R8-1): R8.1 R9.1 U3.17(SA0/H_MOSI)
Net-(U32-9): U32.9(RESET_N) U33.2

Not connected (* = marked no-connect by the designer): R1 1; U1 16(GPIO23) 21(GPIO09) 22(GPIO25) 23(GPIO11) 24(GPIO08) 26(GPIO07) 27(ID_SD) 28(ID_SC) 32(GPIO12) 33(GPIO13) 37(GPIO26) 40(GPIO21); U2 4(NC)*; U3 1(RESV_NC)* 7(RESV_NC)* 8(RESV_NC)* 10(CLKSEL0)* 12(RESV_NC)* 13(RESV_NC)* 15(ENV_SCL)* 16(ENV_SDA)* 21(RESV_NC)* 22(RESV_NC)* 23(RESV_NC)* 24(RESV_NC)*; U5 A5(DATA_P)* A6(DATA_N)* A8(CLK_P)* A9(CLK_N)* D12(SYNC_IN)* E3(VHV)* E11(AP_CLK)* E12(ATEST0)*; U26 3(Alert)* 5(A2)* 6(A1)* 7(A0)*; U31 3(DOUT)*; U32 7(RESERVED)* 15(RESERVED)* 16(RESERVED)* 17(RESERVED)* 18(SET)*; U36 4(VOUT)

## Notes on the sheet
- Colour Sensor
- IMU BN0080
- ALS
- logic level shifter-Temp
- logic level shifter-ToF
- Temp
- 3DToF
- MIC
- GPS
- logic level shifter-Bar
- Barometer
- LDO 3.3V @1A
- LDO 1.2V @1A
- LDO 1.8V @1A
